# Altium schematic sheet Kello_Nixie_PWR.SchDoc
size A4; ApprovedBy: Krzysztof Belewicz; CheckedBy: Krzysztof Belewicz; Author: Krzysztof Belewicz; DrawnBy: Krzysztof Belewicz; Engineer: Krzysztof Belewicz; Revision: 1.0; SheetNumber: 3; SheetTotal: 4
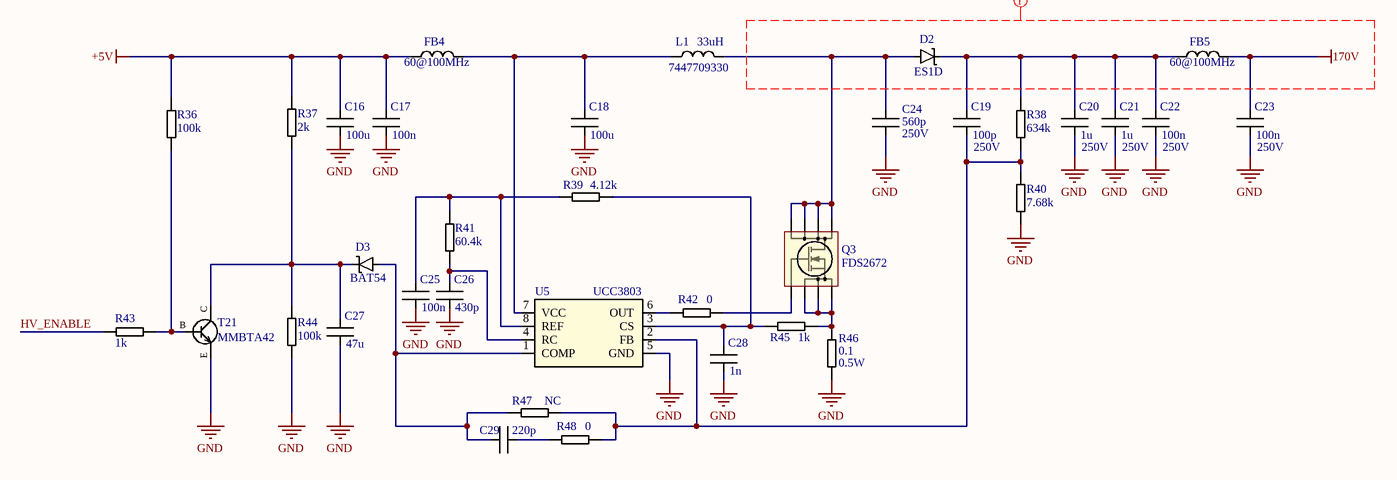
[diagram p0: Kello_Nixie_PWR.SchDoc]

## Parts
C16  value 100u  [CAPC4532N]  (hidden comment: Capacitor)
C17  value 100n  [CAPC1608N]  (hidden comment: Capacitor)
C18  value 100u  [CAPC4532N]  (hidden comment: Capacitor)
C19  value 100p  MaxVoltage: 250V  [CAPC1608N]  (hidden comment: Capacitor)
C20  value 1u  MaxVoltage: 250V  [CAPC4532N]  (hidden comment: Capacitor)
C21  value 1u  MaxVoltage: 250V  [CAPC4532N]  (hidden comment: Capacitor)
C22  value 100n  MaxVoltage: 250V  [CAPC3216N]  (hidden comment: Capacitor)
C23  value 100n  MaxVoltage: 250V  [CAPC3216N]  (hidden comment: Capacitor)
C24  value 560p  MaxVoltage: 250V  [CAPC1608N]  (hidden comment: Capacitor)
C25  value 100n  [CAPC1608N]  (hidden comment: Capacitor)
C26  value 430p  [CAPC1608N]  (hidden comment: Capacitor)
C27  value 47u  [CAPC3225N]  (hidden comment: Capacitor)
C28  value 1n  [CAPC1608N]  (hidden comment: Capacitor)
C29  value 220p  [CAPC1608N]  (hidden comment: Capacitor)
D2  ES1D  [SUB-SMA]
D3  BAT54  [SOD-523F]
FB4  value 60@100MHz  [INDC1608N]  (hidden comment: Ferrite Bead)
FB5  value 60@100MHz  [INDC1608N]  (hidden comment: Ferrite Bead)
L1  7447709330  value 33uH  [WE_PD]
Q3  FDS2672  [SO8_N]
R36  value 100k  [RESC1608N]  (hidden comment: Resistor)
R37  value 2k  [RESC1608N]  (hidden comment: Resistor)
R38  value 634k  [RESC3216N]  (hidden comment: Resistor)
R39  value 4.12k  [RESC1608N]  (hidden comment: Resistor)
R40  value 7.68k  [RESC3216N]  (hidden comment: Resistor)
R41  value 60.4k  [RESC1608N]  (hidden comment: Resistor)
R42  value 0  [RESC1608N]  (hidden comment: Resistor)
R43  value 1k  [RESC1608N]  (hidden comment: Resistor)
R44  value 100k  [RESC1608N]  (hidden comment: Resistor)
R45  value 1k  [RESC1608N]  (hidden comment: Resistor)
R46  value 0.1  Power: 0.5W  [RESC3216N]  (hidden comment: Resistor)
R47  value NC  [RESC1608N]  (hidden comment: Resistor)
R48  value 0  [RESC1608N]  (hidden comment: Resistor)
T21  MMBTA42  [SOT23-3N]
U5  UCC3803  [SOIC8+PAD (SOIC127P600X170_HS-9N)]

## Nets
170V: C23.2 FB5.2
+5V: C16.2 C17.2 FB4.1 R36.1 R37.1
GND: C16.1 C17.1 C18.1 C20.1 C21.1 C22.1 C23.1 C24.1 C25.1 C26.1 C27.1 C28.1 R40.2 R44.2 R46.2 T21.E U5.5(GND)
HV_ENABLE: R43.1
NetC18_2: C18.2 FB4.2 L1.1 U5.7(VCC)
NetC19_1: C19.1 R38.2 R40.1 R47.2 R48.2 U5.2(FB)
NetC19_2: C19.2 C20.2 C21.2 C22.2 D2.K FB5.1 R38.1
NetC24_2: C24.2 D2.A L1.2 Q3.5(D) Q3.6(D) Q3.7(D) Q3.8(D)
NetC25_2: C25.2 R39.1 R41.1 U5.8(REF)
NetC26_2: C26.2 R41.2 U5.4(RC)
NetC27_2: C27.2 D3.K R37.2 R44.1 T21.C
NetC28_2: C28.2 R39.2 R45.1 U5.3(CS)
NetC29_1: C29.1 R48.1
NetC29_2: C29.2 D3.A R47.1 U5.1(COMP)
NetQ3_1: Q3.1(S) Q3.2(S) Q3.3(S) R45.2 R46.1
NetQ3_4: Q3.4(G) R42.2
NetR36_2: R36.2 R43.2 T21.B
NetR42_1: R42.1 U5.6(OUT)

## Layout directives
rule Clearance Constraint [Clearance = 19.685mil]; net class HIGH VOLTAGE: 170V

## Notes on the sheet
- Project:
- Variant:
- File:
- Sheet:
- Revision:
- Total Sheet:
- Author:
- Modified:

## Library data of the parts
C16 C18 = Capacitor: Manufacturer Part Number 1: C4532X5R1A107M280KC; Manufacturer 1: TDK; Tolerance: 20%; MaxVoltage: 10V; Supplier 1: Farnell; Supplier Part Number 1: 2525204
C17 C25 = Capacitor: Manufacturer Part Number 1: CL10F104ZA8NNNC; Manufacturer 1: SAMSUNG; Tolerance: -20/+80%; MaxVoltage: 25V; Supplier 1: TME; Supplier Part Number 1: CL10F104ZA8NNNC
C19 = Capacitor: Manufacturer Part Number 1: 885342006003; Manufacturer 1: WURTH ELEKTRONIK; Tolerance: 5%; Supplier 1: Farnell; Supplier Part Number 1: 2812519
C20 C21 = Capacitor: Manufacturer Part Number 1: CGA8P3X7T2E105K250KA; Manufacturer 1: TDK; Tolerance: 10%; Supplier 1: Farnell; Supplier Part Number 1: 2435499
C22 C23 = Capacitor: Manufacturer Part Number 1: C1206C104KARECAUTO; Manufacturer 1: KEMET; Tolerance: 10%; Supplier 1: Farnell; Supplier Part Number 1: 2852360
C24 = Capacitor: Manufacturer Part Number 1: C0603C561JAGACAUTO; Manufacturer 1: KEMET; Tolerance: 5%; Supplier 1: Farnell; Supplier Part Number 1: 2810275
C26 = Capacitor: Manufacturer 1: KEMET; Manufacturer Part Number 1: C0603C431J5GACTU; Tolerance: 5%; MaxVoltage: 50V; Supplier 1: Farnell; Supplier Part Number 1: 2821196
C27 = Capacitor: Manufacturer 1: KEMET; Manufacturer Part Number 1: C1210C476M4PACTU; Tolerance: 20%; MaxVoltage: 16V; Supplier 1: Farnell; Supplier Part Number 1: 1838761
C28 = Capacitor: Manufacturer Part Number 1: VJ0603Y102KXACW1BC; Manufacturer 1: VISHAY; Tolerance: 10%; MaxVoltage: 50V; Supplier 1: TME; Supplier Part Number 1: VJ0603Y102KXACW1BC
C29 = Capacitor: Manufacturer Part Number 1: VJ0603Y221KXACW1BC; Manufacturer 1: VISHAY; Tolerance: 10%; MaxVoltage: 50V; Supplier 1: TME; Supplier Part Number 1: VJ0603Y221KXACW1BC
D2 = SS19L: Dioda: prostownicza; SMD; 200V; 1A; 15ns; 1,47W; SMA; Ifsm:30A; Manufacturer: ON SEMICONDUCTOR; Max Current: 1A; Max Reverse Voltage: 200V; Supplier 1: TME; Manufacturer Part Number: ES1D; Supplier Part Number 1: ES1D
D3 = BAT54XV2: Fairchild BAT54XV2, Schottky, 200mA, 30V; Supplier 1: Farnell; Supplier Part Number 1: 2322476; Forward Current: 200mA; Max Reverse Voltage: 30V; Manufacturer: Fairchild; Manufacturer Part Number: BAT54XV2; Supplier 2: RS-Components; Supplier Part Number 2: 690-0029
FB4 FB5 = Inductor: Manufacturer Part Number 1: BLM18BB600SN1D; Manufacturer 1: MURATA; Max Current: 0.55A; Supplier 1: TME; Supplier Part Number 1: BLM18BB600SN1D
L1 = 7447709330: Cewka zasilająca (SMD), 33 µH, 4.2 A, Osłonięte, 5.5 A, Seria WE-PD, 12mm x 12mm x 10mm; Manufacturer 1: WURTH ELEKTRONIK; Tolerance: 20%; Max Current RMS: 4.2A; Supplier 1: Farnell; Supplier Part Number 1: 2082654; Manufacturer Part Number 1: 7447709330
Q3 = FDS2672: Tranzystor: N-MOSFET; unipolarny; 200V; 3,9A; 2,5W; SO8; UltraFET®; Manufacturer 1: ON SEMICONDUCTOR (FAIRCHILD); Max Current: 3.9A; Supplier Part Number 1: FDS2672; Supplier 1: TME; Manufacturer Part Number 1: FDS2672; Max Voltage: 200V
R36 R44 = Resistor: Manufacturer 1: VISHAY; Manufacturer Part Number 1: CRCW0603100KFKEA; Tolerance: 1%; Power: 0.1W; Supplier 1: TME; Supplier Part Number 1: CRCW0603100KFKEA
R37 = Resistor: Manufacturer 1: ROYAL OHM; Manufacturer Part Number 1: 0603SAF2001T5E; Tolerance: 1%; Power: 0.1W; Supplier 1: TME; Supplier Part Number 1: SMD0603-2K-1%
R38 = Resistor: Manufacturer 1: VISHAY; Manufacturer Part Number 1: CRCW1206634KFKEA.; Tolerance: 1%; Power: 0.25W; Supplier 1: Farnell; Supplier Part Number 1: 2139670
R39 = Resistor: Manufacturer Part Number 1: CRCW06034K12FKEA; Manufacturer 1: VISHAY; Tolerance: 1%; Power: 0.1W; Supplier 1: Farnell; Supplier Part Number 1: 1652883
R40 = Resistor: Manufacturer 1: PANASONIC; Manufacturer Part Number 1: ERJ8ENF7681V; Tolerance: 1%; Power: 0.25W; Supplier 1: Farnell; Supplier Part Number 1: 2307849
R41 = Resistor: Manufacturer 1: VISHAY; Manufacturer Part Number 1: CRCW060360K4FKEA.; Tolerance: 1%; Power: 0.1W; Supplier 1: Farnell; Supplier Part Number 1: 2138476
R42 R48 = Resistor: Manufacturer Part Number 1: CRCW06030000Z0TABC; Manufacturer 1: VISHAY; Tolerance: 1%; Power: 0.1W; Supplier 1: TME; Supplier Part Number 1: CRCW06030000Z0TABC
R43 R45 = Resistor: Manufacturer 1: ROYAL OHM; Manufacturer Part Number 1: 0603SAF1001T5E; Tolerance: 1%; Power: 0.1W; Supplier 1: TME; Supplier Part Number 1: SMD0603-1K-1%
R46 = Resistor: Manufacturer 1: WELWYN; Manufacturer Part Number 1: LR1206-R10FW; Tolerance: 1%; Supplier 1: Farnell; Supplier Part Number 1: 1099914
R47 = Resistor: Tolerance: 1%; Power: 0.1W; Supplier 1: *; Manufacturer 1: *; Supplier Part Number 1: *; Manufacturer Part Number 1: *
T21 = 2N3707: NPN Transistor; pin to pad: B>1 C>3 E>2; Supplier 1: TME; Supplier Part Number 1: MMBTA42LT1G
U5 = UCC3803: Kontroler PWM current mode, zasilanie 12V-3.6V, 1 MHz, wyjście 1V/1A, SOIC-8; Manufacturer Part Number 1: UCC3803D; Manufacturer 1: TEXAS INSTRUMENTS; Supplier 1: Farnell; Supplier Part Number 1: 2323690